# EasyEDA Pro project Micro-SD-Card-Adapter.eprj

# Schematic Schematic1
Create Date: 2023-11-06; Page Name: P1; Project Name: Micro SD Card Adapter; Schematic Name: Schematic1; Update Date: 2023-11-06; Company: 嘉立创EDA; Page Size: A4; Version: V1.0
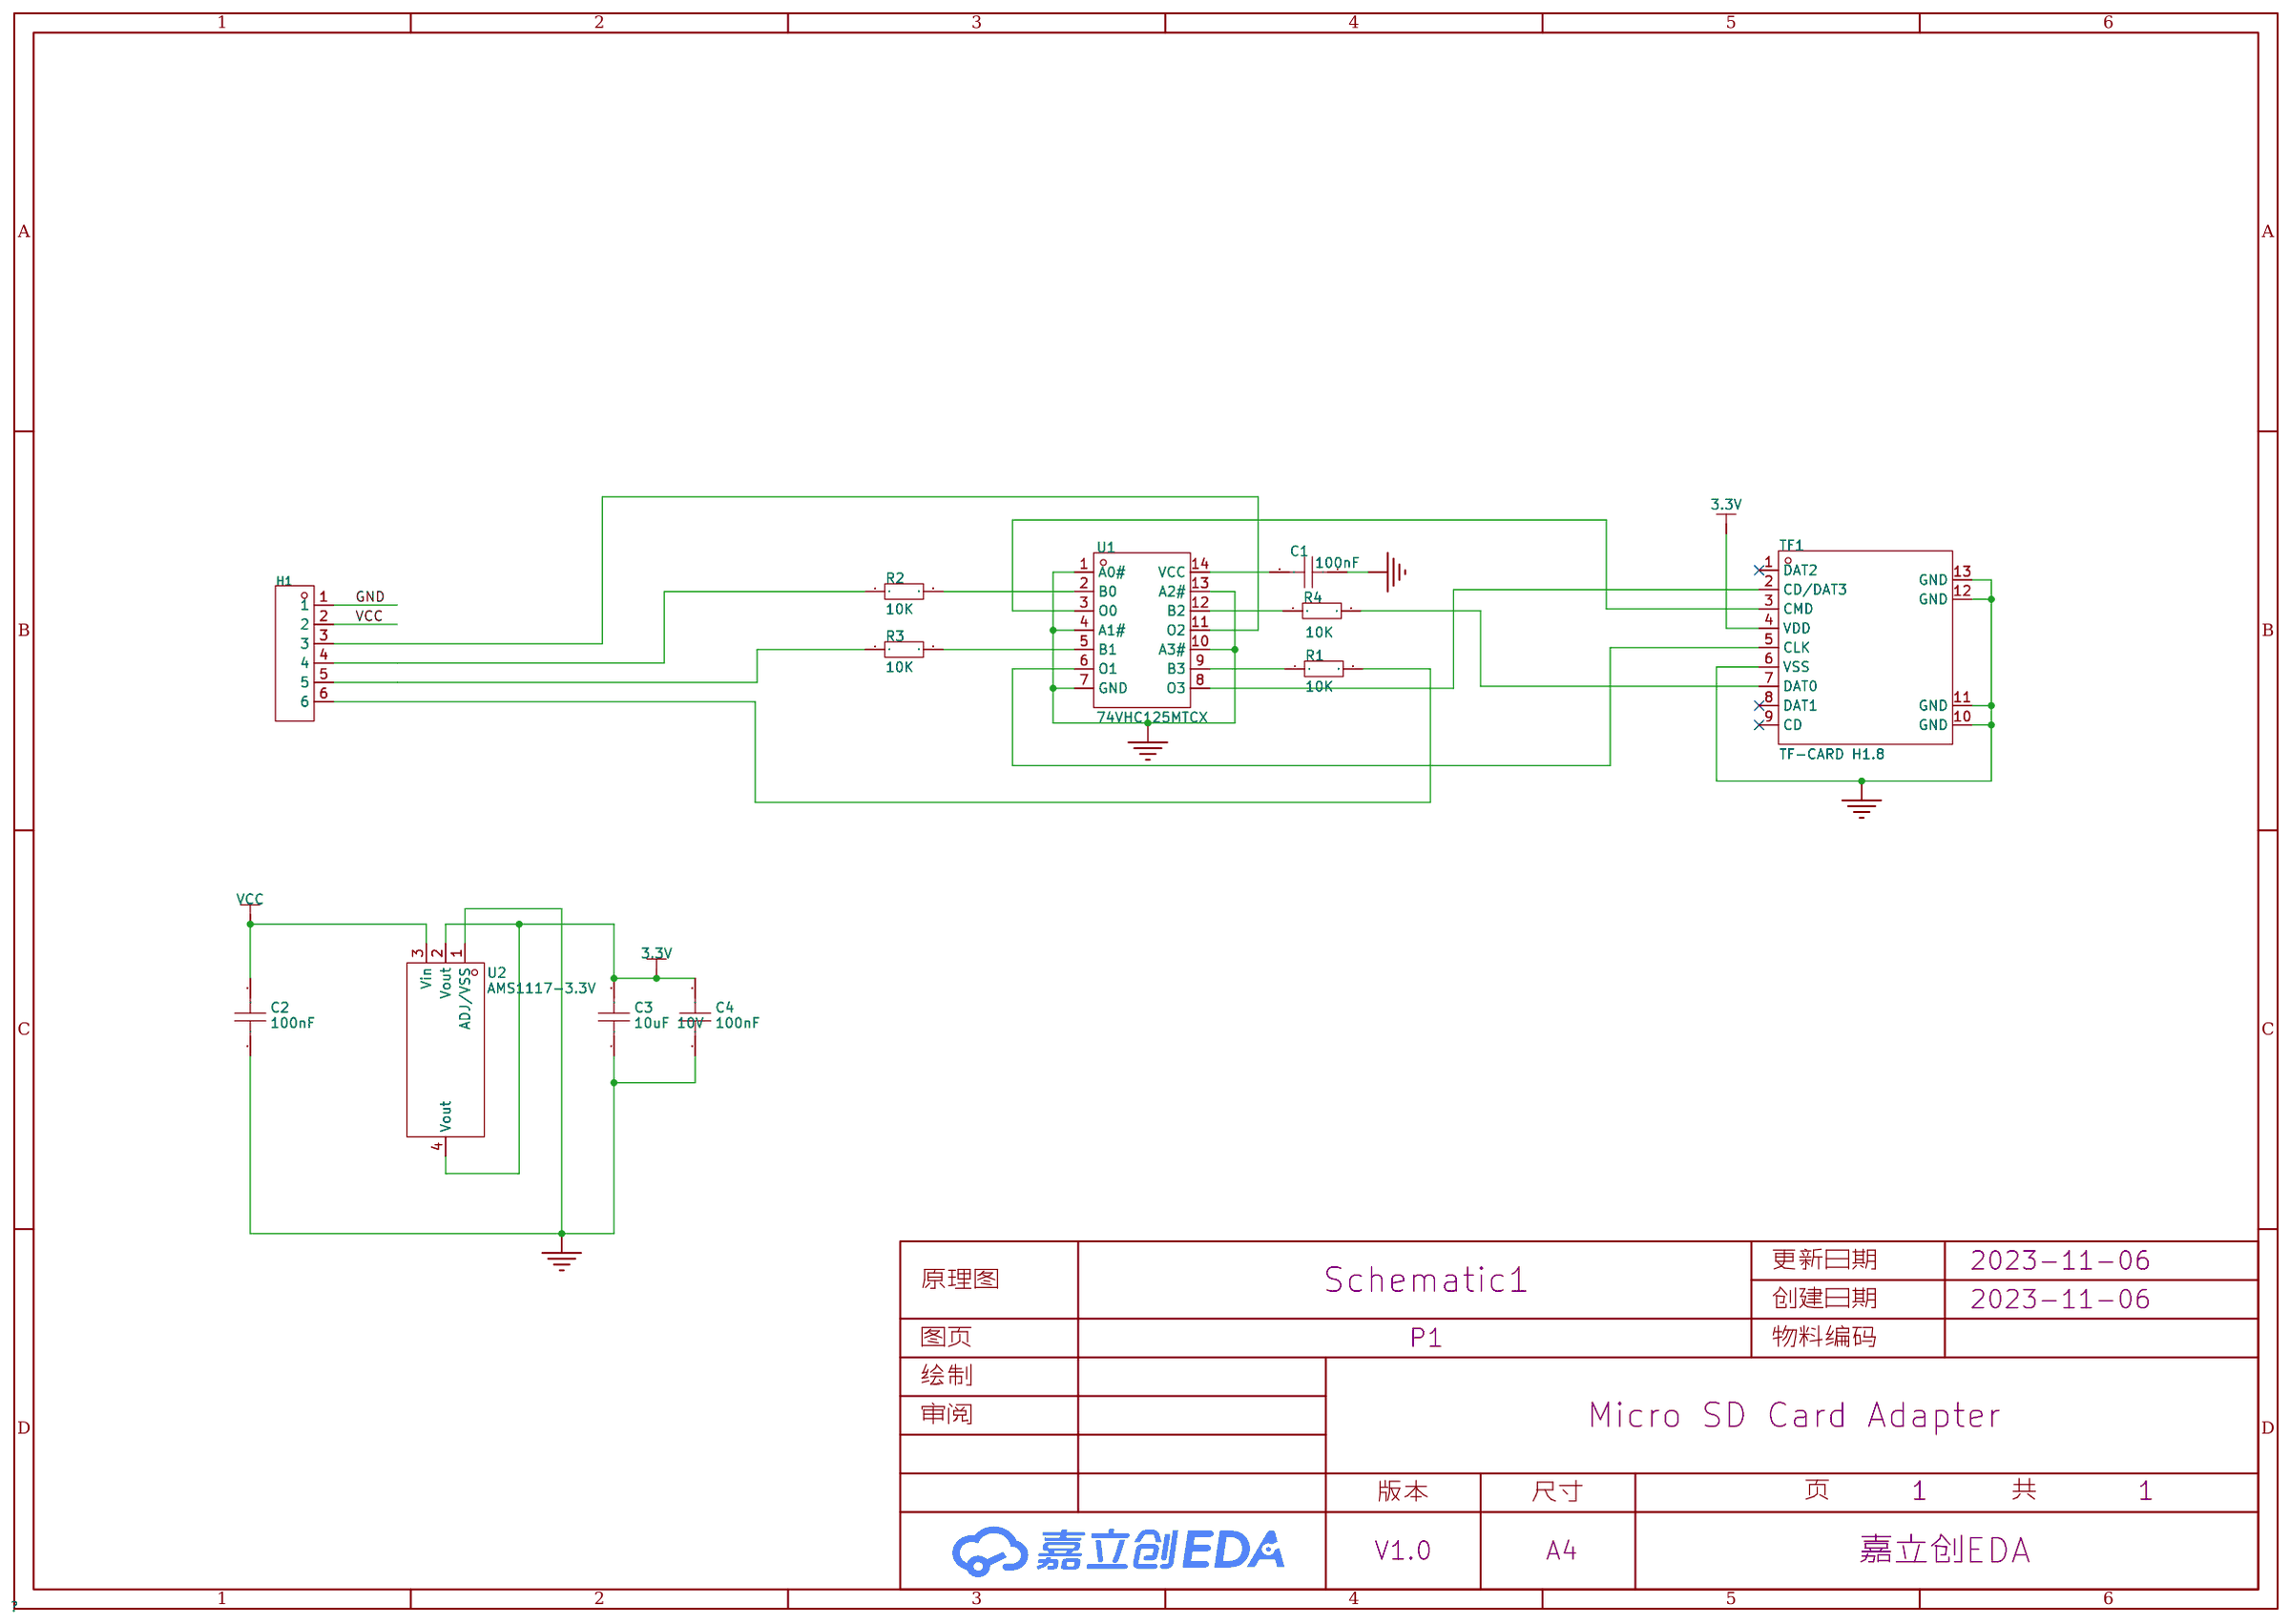
[diagram p0: schematic sheet]

## Parts
C1  100nF  [C0603]
C2  100nF  [C0603]
C3  10uF 10V  [C0805]
C4  100nF  [C0603]
H1  -  [HDR-TH_6P-P2.54-V-F]
R1  10K  [R0603]
R2  10K  [R0603]
R3  10K  [R0603]
R4  10K  [R0603]
TF1  TF-CARD H1.8  [TF-SMD_TF-CARD-H1.8]
U1  74VHC125MTCX  [TSSOP-14_L5.0-W4.4-P0.65-LS6.5-BL]
U2  AMS1117-3.3V  [SOT-223-3_L6.5-W3.4-P2.30-LS7.0-BR]

## Library data of the parts
C1 C2 C4 = CAP_0603: Supplier Footprint: 0603
C3 = CAP_0805: Supplier Footprint: 0805
H1 = HDR-F_2.54_1x6P: Supplier Part: C40877; Supplier Footprint: 插件
R1-R4 = Res_0603: Supplier Footprint: 0603
TF1 = TF-CARD H1.8: 卡连接方式:自弹式;卡类型:MicroSD卡(TF卡);连接器类型:卡座;本体最大高度:1.8mm;触头材质:铜合金;触头镀层:金;工作温度范围:-40℃~+70℃;; LCSC Part Name: 自弹式 MicroSD卡(TF卡) 卡座; Supplier Part: C7529389; Manufacturer: SHOU HAN(首韩); Supplier Footprint: SMD; Datasheet: https://atta.szlcsc.com/upload/public/pdf/source/20230818/611DB5E7B45C91025B0B37F957961A64.pdf; Supplier: LCSC; Card Connection Mode: 自弹式; Card Type: MicroSD卡(TF卡); Connector Type: 卡座; Maximum Body Height: 1.8mm; Contact Material: 铜合金; Contact Plating: 金; Operating Temperature Range: -40℃~+70℃
U1 = 74VHC125MTCX: 74VHC Series High Speed Quad Buffer w/ 3-STATE Output - TSSOP-14; Supplier Part: C6143; Manufacturer: onsemi(安森美); Supplier Footprint: TSSOP-14; Datasheet: https://atta.szlcsc.com/upload/public/pdf/source/20120508/1457706494774.pdf; Supplier: LCSC
U2 = AMS1117-3.3V_C5205141: 最大输入电压:18V;输出电压:3.3V;输出电流:800mA;; Supplier Part: C5205141; Manufacturer: JSMSEMI(杰盛微); Supplier Footprint: SOT-223; Datasheet: https://atta.szlcsc.com/upload/public/pdf/source/20221108/12B7F8780D3A348CCE0440A8EB50B6CD.pdf; Supplier: LCSC; Maximum Input Voltage: 18V; Output Voltage: 3.3V; Output Current: 800mA

## Nets
3.3V: C3.2 C4.2 TF1.4(VDD) U2.2(Vout) U2.4(Vout)
GND: C1.1 C2.1 C3.1 C4.1 H1.1 TF1.6(VSS) TF1.10(GND) TF1.11(GND) TF1.12(GND) TF1.13(GND) U1.1(A0#) U1.4(A1#) U1.7(GND) U1.10(A3#) U1.13(A2#) U2.1(ADJ/VSS)
VCC: C2.2 H1.2 U2.3(Vin)
$1N845: TF1.2(CD/DAT3) U1.8(O3)
$1N879: TF1.3(CMD) U1.3(O0)
$1N896: TF1.5(CLK) U1.6(O1)
$1N922: R4.1 U1.12(B2)
$1N928: R4.2 TF1.7(DAT0)
$1N936: R3.2 U1.5(B1)
$1N939: R2.2 U1.2(B0)
$1N971: C1.2 U1.14(VCC)
$1N1198: H1.3 U1.11(O2)
$1N1201: H1.4 R2.1
$1N1207: H1.5 R3.1
$1N1213: H1.6 R1.2
$1N1229: R1.1 U1.9(B3)

Not connected (* = marked no-connect by the designer): TF1 1(DAT2)* 8(DAT1)* 9(CD)*

# Board PCB1
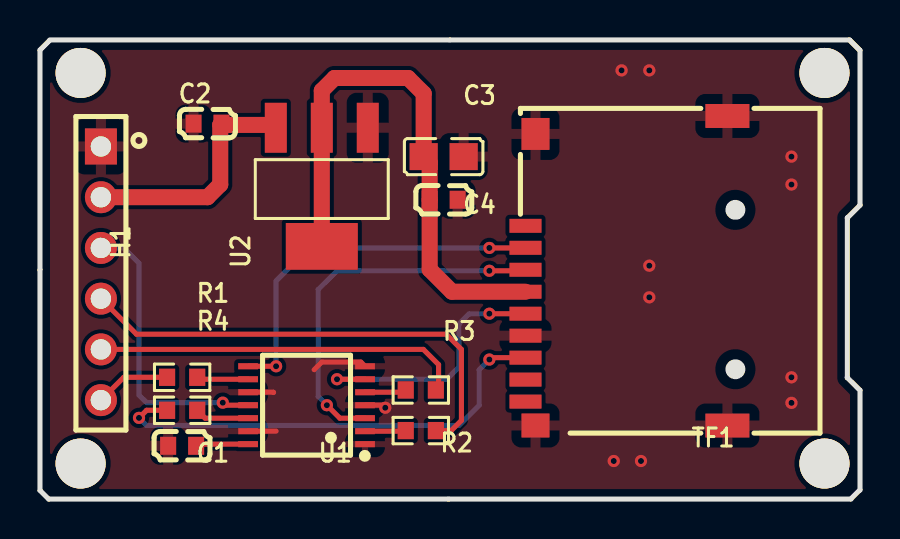
[diagram p1: board, top side]
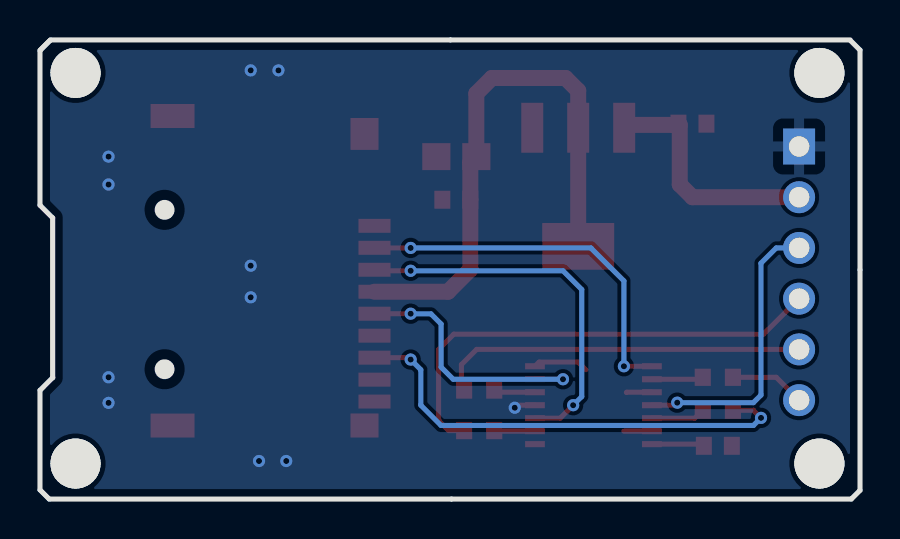
[diagram p2: board, bottom side, seen from below]

Outline 41.02 x 22.99 mm; copper layers: Top Layer, Bottom Layer. Coordinates in mm from the lower left corner of the outline.
Outline path: 0.47,22.95 0,22.48 0,0.44 0.44,0 40.56,0 41.02,0.46 41.02,5.44 40.39,6.08 ; 0.49,22.99 40.5,22.99 41.02,22.46 41.02,14.71 40.39,14.08 40.39,6.08 ; 40.39,6.08 40.39,6.1 ; 40.98,22.5 40.55,22.93
Stack: Top Layer 0.035mm / Dielectric1 1.51mm FR4 er 4.5 / Bottom Layer 0.035mm

## Design rules (mm)
template: 自定义配置
spacing copperThickness1oz (default): track to track 0.102, other pairs 0.152 to 0.3
spacing copperThickness2oz: track to track 0.203, other pairs 0.152 to 0.3
track width copperThickness1oz (default): min 0.127, default 0.254, max 2.54
track width copperThickness2oz: min 0.203, default 0.254, max 2.54
differential pair differentialPair (default): width min 0.127, default 0.254, max 2.54; gap min 0.152, default 0.152
via viaSize (default): diameter min 0.5, default 0.61, max 10; hole min 0.3, default 0.305, max 6.3

## Placement (name value [footprint] x y rotation side)
C1  100nF  [C0603]  7.11 2.67 0 top
C2  100nF  [C0603]  8.38 18.8 0 top
C3  10uF 10V  [C0805]  20.19 17.14 180 top
C4  100nF  [C0603]  20.19 14.99 180 top
H1  -  [HDR-TH_6P-P2.54-V-F]  3.05 11.3 270 top
NOREF  -  [Pad_e33]  39.24 21.34 0 top
NOREF#2  -  [Pad_e32]  2.03 21.34 0 top
NOREF#3  -  [Pad_e34]  39.24 1.78 0 top
NOREF#4  -  [Pad_e30]  2.03 1.78 0 top
R1  10K  [R0603]  7.11 6.1 180 top
R2  10K  [R0603]  19.05 3.43 180 top
R3  10K  [R0603]  19.05 5.46 180 top
R4  10K  [R0603]  7.11 4.44 180 top
TF1  TF-CARD H1.8  [TF-SMD_TF-CARD-H1.8]  29.34 11.43 90 top
U1  74VHC125MTCX  [TSSOP-14_L5.0-W4.4-P0.65-LS6.5-BL]  13.33 4.7 90 top
U2  AMS1117-3.3V  [SOT-223-3_L6.5-W3.4-P2.30-LS7.0-BR]  14.1 15.62 90 top

## Footprints (pads in the part's own frame, mm; a bottom-side part is the same pattern mirrored in y, then rotated)
C0603
  rect 0.8x0.9 smd: 1(-0.7,0) 2(0.7,0)
C0805
  rect 1.41x1.35 smd: 1(-1,0) 2(1,0)
HDR-TH_6P-P2.54-V-F
  rect 1.8x1.6 hole 1.02: 1(-6.35,0)
  round 1.6 hole 1.02: 2(-3.81,0) 3(-1.27,0) 4(1.27,0) 5(3.81,0) 6(6.35,0)
Pad_e30
  round 2.5 hole 2.5: 0(0,0)
Pad_e32
  round 2.5 hole 2.5: 0(0,0)
Pad_e33
  round 2.5 hole 2.5: 0(0,0)
Pad_e34
  round 2.5 hole 2.5: 0(0,0)
R0603
  rect 0.806x0.864 smd: 1(-0.753,0) 2(0.753,0)
SOT-223-3_L6.5-W3.4-P2.30-LS7.0-BR
  rect 2.5x1.1 smd: 1(2.97,-2.3) 2(2.97,0) 3(2.97,2.3)
  rect 2.34x3.6 smd: 4(-2.97,0)
TF-SMD_TF-CARD-H1.8
  rect 0.7x1.6 smd: 1(2.25,5.05) 2(1.15,5.05) 3(0.05,5.05) 4(-1.05,5.05) 5(-2.15,5.05) 6(-3.25,5.05) 7(-4.35,5.05) 8(-5.45,5.05) 9(-6.55,5.05)
  rect 1.2x1.4 smd: 10(-7.747,4.55)
  rect 1.2x2.2 smd: 11(-7.75,-5.05) 12(7.75,-5.05)
  rect 1.6x1.4 smd: 13(6.85,4.55)
TSSOP-14_L5.0-W4.4-P0.65-LS6.5-BL
  rect 0.305x0.991 smd: 1(-1.95,-2.925) 2(-1.3,-2.925) 3(-0.65,-2.925) 4(0,-2.925) 5(0.65,-2.925) 6(1.3,-2.925) 7(1.95,-2.925) 8(1.95,2.925) 9(1.3,2.925) 10(0.65,2.925) 11(0,2.925) 12(-0.65,2.925) 13(-1.3,2.925) 14(-1.95,2.925)

## Nets
As in the schematic.

Pads without a net: NOREF 0; NOREF#2 0; NOREF#3 0; NOREF#4 0; TF1 1 8 9

## Via types
v1: diameter 0.61, hole 0.305, Top Layer to Bottom Layer, 20 vias

## Routing (per net, layer and track width the routed paths; a pad name or vN(x,y) marks a point on that pad's centre or on a via; arc(x,y) is an arc through that point)
3.3V: length 27.7
  Top Layer w0.8: U2.4 U2.2 14.1,20.45 14.73,21.08 18.42,21.08 19.19,20.3 C3.2 19.49,16.84 C4.2 19.49,11.49 20.61,10.38 TF1.4
GND: length 6.5
  Top Layer w0.254: U1.4 17.14,4.7 v1(17.27,4.57) ; U1.10 11.67,5.35 11.68,5.33 ; U1.7 16.05,6.86 14.1,6.86 13.72,6.48 ; U1.13 11.81,3.4
  vias: v1(28.7,1.9) v1(29.09,21.46) v1(30.06,1.9) v1(30.48,21.46) v1(30.48,11.68) v1(30.48,10.1) v1(37.59,17.14) v1(37.59,15.75) v1(37.59,6.1) v1(37.59,4.82)
VCC: length 12.1
  Top Layer w0.5: 9.02,18.73 C2.2
  Top Layer w0.8: H1.2 8.38,15.11 9.02,15.75 9.02,18.73 11.66,18.73 U2.3
$1N845: length 18.8
  Top Layer w0.254: U1.8 v1(11.81,6.65) ; TF1.2 24.28,12.57 v1(22.48,12.57)
  Bottom Layer w0.254: v1(11.81,6.65) 11.81,10.92 13.46,12.57 v1(22.48,12.57)
$1N879: length 18.9
  Top Layer w0.254: TF1.3 24.24,11.43 v1(22.48,11.43) ; U1.3 15,4.05 v1(14.35,4.7)
  Bottom Layer w0.254: v1(14.35,4.7) 13.92,5.13 13.92,10.49 14.86,11.43 v1(22.48,11.43)
$1N896: length 13.5
  Top Layer w0.254: TF1.5 v1(22.48,9.28) ; U1.6 v1(14.86,6)
  Bottom Layer w0.254: v1(22.48,9.28) 22.47,9.27 21.46,9.27 20.95,8.76 20.95,6.6 20.35,6 v1(14.86,6)
$1N922: length 2.7
  Top Layer w0.254: R4.1 8.26,4.05 U1.12
$1N928: length 23.5
  Top Layer w0.254: TF1.7 22.57,7.08 v1(22.48,6.98) ; v1(4.95,4.06) 5.33,4.44 R4.2
  Bottom Layer w0.254: v1(22.48,6.98) 21.97,6.48 21.97,4.7 20.95,3.68 5.33,3.68 v1(4.95,4.06)
$1N936: length 2.1
  Top Layer w0.254: R3.2 18.18,5.35 U1.5
$1N939: length 2
  Top Layer w0.254: U1.2 18.27,3.4 R2.2
$1N971: length 2.6
  Top Layer w0.254: U1.14 7.89,2.75 C1.2
$1N1198: length 14.6
  Top Layer w0.254: U1.11 9.27,4.7 v1(9.14,4.83)
  Bottom Layer w0.254: H1.3 4.19,12.57 4.95,11.81 4.95,5.21 5.33,4.83 9.27,4.83
$1N1201: length 24.1
  Top Layer w0.254: H1.4 4.83,8.25 20.32,8.25 21.08,7.49 21.08,3.94 20.57,3.43 R2.1
$1N1207: length 18.5
  Top Layer w0.254: R3.1 19.94,5.6 19.94,6.73 19.18,7.49 H1.5
$1N1213: length 3.8
  Top Layer w0.254: R1.2 4.19,6.1 H1.6
$1N1229: length 2.6
  Top Layer w0.254: R1.1 7.96,6 U1.9

## Copper pours and planes (outline as drawn; the poured copper is in the pictures)
GND on Top Layer: -0.64,23.49 41.78,23.49 41.78,-0.51 -0.64,-0.51
GND on Bottom Layer: -0.89,23.62 42.04,23.62 42.04,-0.76 -0.89,-0.76
